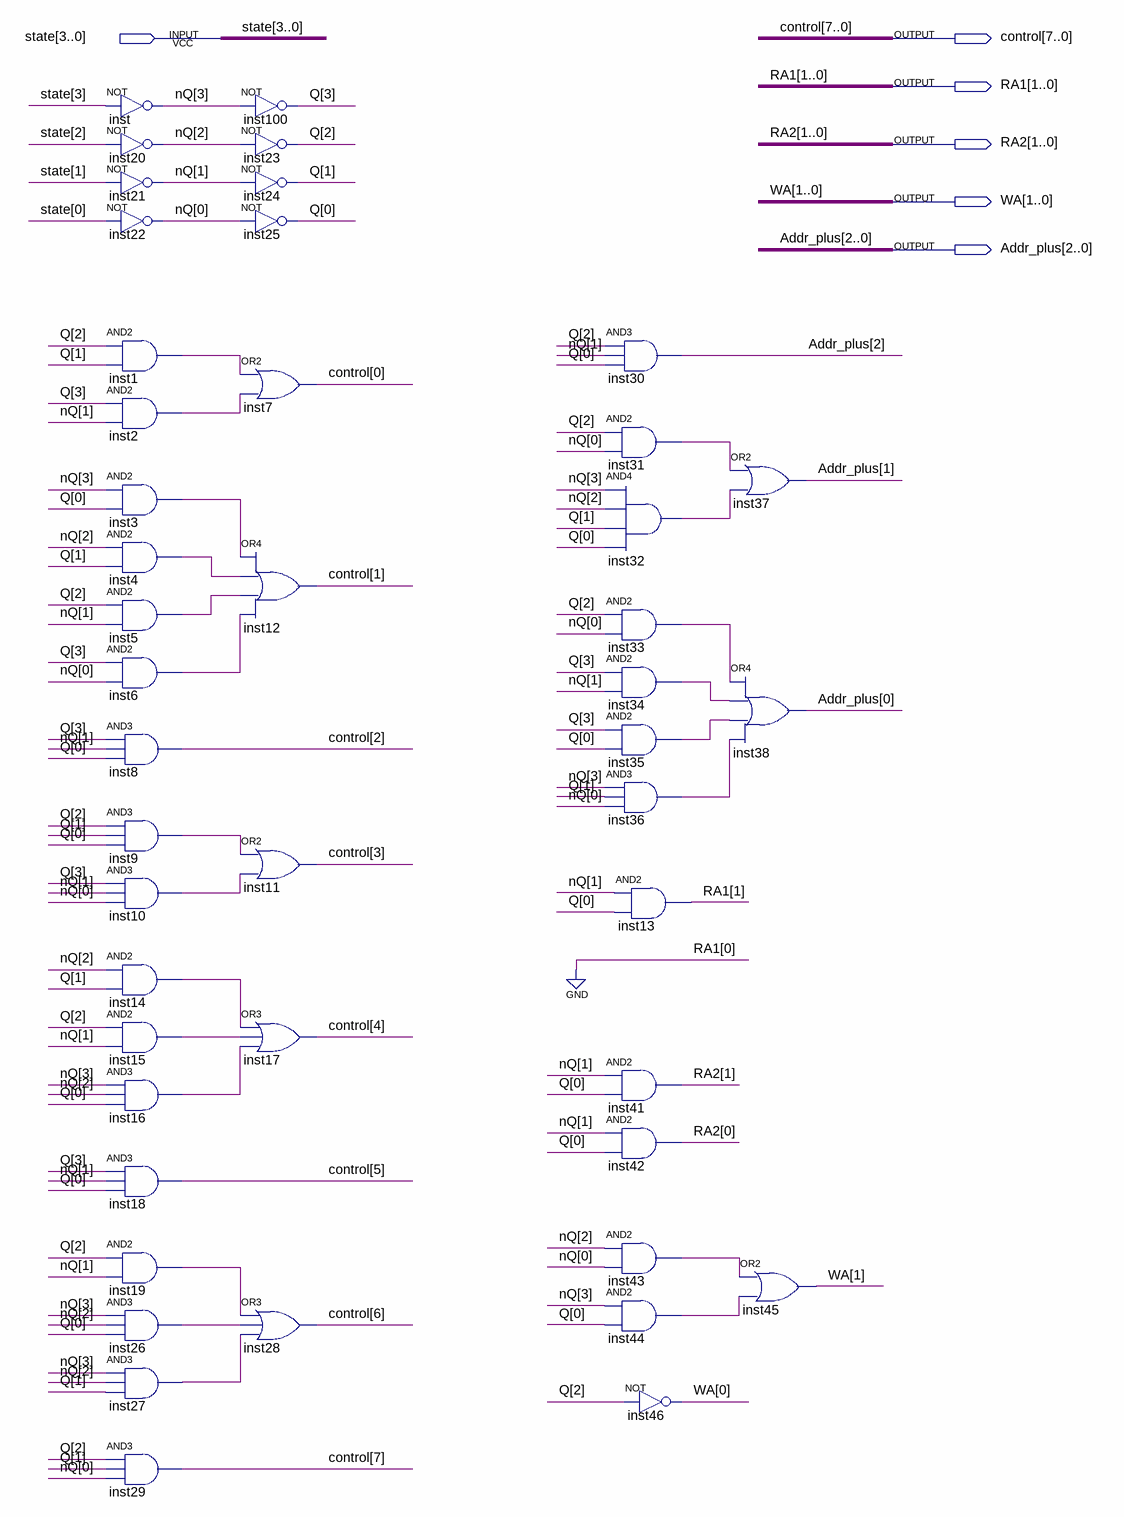
[diagram p0: schematic sheet]
// Quartus schematic logic.bdf as structural Verilog: 46 symbols, 6 pins
module \logic  (
  input  [3:0] state,
  output [7:0] control,
  output [1:0] RA1,
  output [1:0] RA2,
  output [1:0] WA,
  output [2:0] Addr_plus
);

  wire inst1_out, inst2_out, inst3_out, inst4_out, inst5_out, inst6_out, inst9_out, inst10_out, inst14_out,
       inst15_out, inst16_out, inst19_out, inst26_out, inst27_out, inst31_out, inst32_out, inst33_out,
       inst34_out, inst35_out, inst36_out, inst43_out, inst44_out;
  wire [3:0] nQ, Q;

  not inst (nQ[3], state[3]);
  not inst20 (nQ[2], state[2]);
  not inst21 (nQ[1], state[1]);
  not inst22 (nQ[0], state[0]);
  and inst1 (inst1_out, Q[2], Q[1]);
  and inst2 (inst2_out, Q[3], nQ[1]);
  and inst3 (inst3_out, nQ[3], Q[0]);
  and inst4 (inst4_out, nQ[2], Q[1]);
  and inst5 (inst5_out, Q[2], nQ[1]);
  and inst6 (inst6_out, Q[3], nQ[0]);
  and inst8 (control[2], Q[3], nQ[1], Q[0]);
  and inst9 (inst9_out, Q[2], Q[1], Q[0]);
  and inst10 (inst10_out, Q[3], nQ[1], nQ[0]);
  and inst14 (inst14_out, nQ[2], Q[1]);
  and inst15 (inst15_out, Q[2], nQ[1]);
  and inst16 (inst16_out, nQ[3], nQ[2], Q[0]);
  and inst18 (control[5], Q[3], nQ[1], Q[0]);
  and inst19 (inst19_out, Q[2], nQ[1]);
  and inst26 (inst26_out, nQ[3], nQ[2], Q[0]);
  and inst27 (inst27_out, nQ[3], nQ[2], Q[1]);
  and inst29 (control[7], Q[2], Q[1], nQ[0]);
  not inst100 (Q[3], nQ[3]);
  not inst23 (Q[2], nQ[2]);
  not inst24 (Q[1], nQ[1]);
  not inst25 (Q[0], nQ[0]);
  or inst7 (control[0], inst1_out, inst2_out);
  or inst12 (control[1], inst3_out, inst4_out, inst5_out, inst6_out);
  or inst11 (control[3], inst9_out, inst10_out);
  or inst17 (control[4], inst14_out, inst15_out, inst16_out);
  or inst28 (control[6], inst19_out, inst26_out, inst27_out);
  and inst30 (Addr_plus[2], Q[2], nQ[1], Q[0]);
  and inst31 (inst31_out, Q[2], nQ[0]);
  and inst32 (inst32_out, nQ[3], nQ[2], Q[1], Q[0]);
  and inst33 (inst33_out, Q[2], nQ[0]);
  and inst34 (inst34_out, Q[3], nQ[1]);
  and inst35 (inst35_out, Q[3], Q[0]);
  and inst36 (inst36_out, nQ[3], Q[1], nQ[0]);
  and inst13 (RA1[1], nQ[1], Q[0]);
  and inst41 (RA2[1], nQ[1], Q[0]);
  and inst42 (RA2[0], nQ[1], Q[0]);
  and inst43 (inst43_out, nQ[2], nQ[0]);
  and inst44 (inst44_out, nQ[3], Q[0]);
  not inst46 (WA[0], Q[2]);
  or inst37 (Addr_plus[1], inst31_out, inst32_out);
  or inst38 (Addr_plus[0], inst33_out, inst34_out, inst35_out, inst36_out);
  or inst45 (WA[1], inst43_out, inst44_out);

  assign RA1[0] = 1'b0;
endmodule
